# Altium schematic sheet InterfaceGSM.SchDoc: CONTROLADORA AIRPOPCORN
size A3; DocumentNumber: 14; SheetNumber: 14; SheetTotal: 15
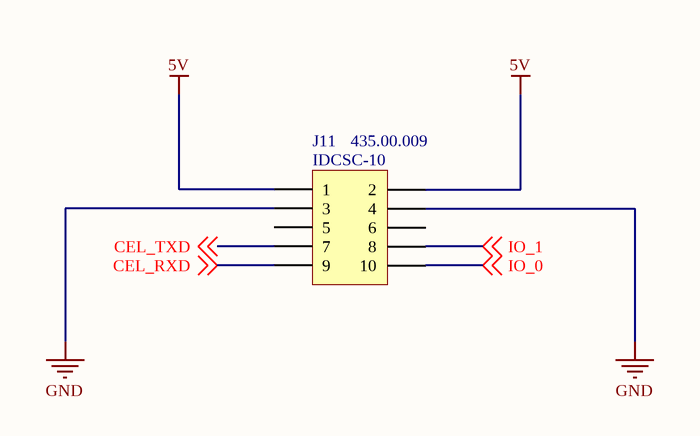
[diagram p0: InterfaceGSM.SchDoc]

## Parts
J11  IDCSC-10  ERP: 435.00.009  [IDCSC-10]

## Nets
5V: J11.1 J11.2
GND: J11.3 J11.4
CEL_RXD: J11.9 ; off-sheet CEL_RXD
CEL_TXD: J11.7 ; off-sheet CEL_TXD
IO_0: J11.10 ; off-sheet IO_0
IO_1: J11.8 ; off-sheet IO_1

Not connected (* = marked no-connect by the designer): J11 5 6

## Notes on the sheet
- NOME
- DATA
- PROJETO
- DESCRIÇÃO
- desenho
- verif.
- aprov.
- TAMANHO
- CODIGO
- Todas as informações disponíveis
- não devem ser divulgadas,
- em parte ou todo.
- CIRCUITO IMPRESSO
- MONTAGEM ELETRÔNICA
- A4
- de

## Library data of the parts
J11 = IDCSN: CONECTOR HEADER 10 VIAS 90º